# Altium schematic sheet Power_Supply.SchDoc
size A3; SheetNumber: 19; SheetTotal: 35
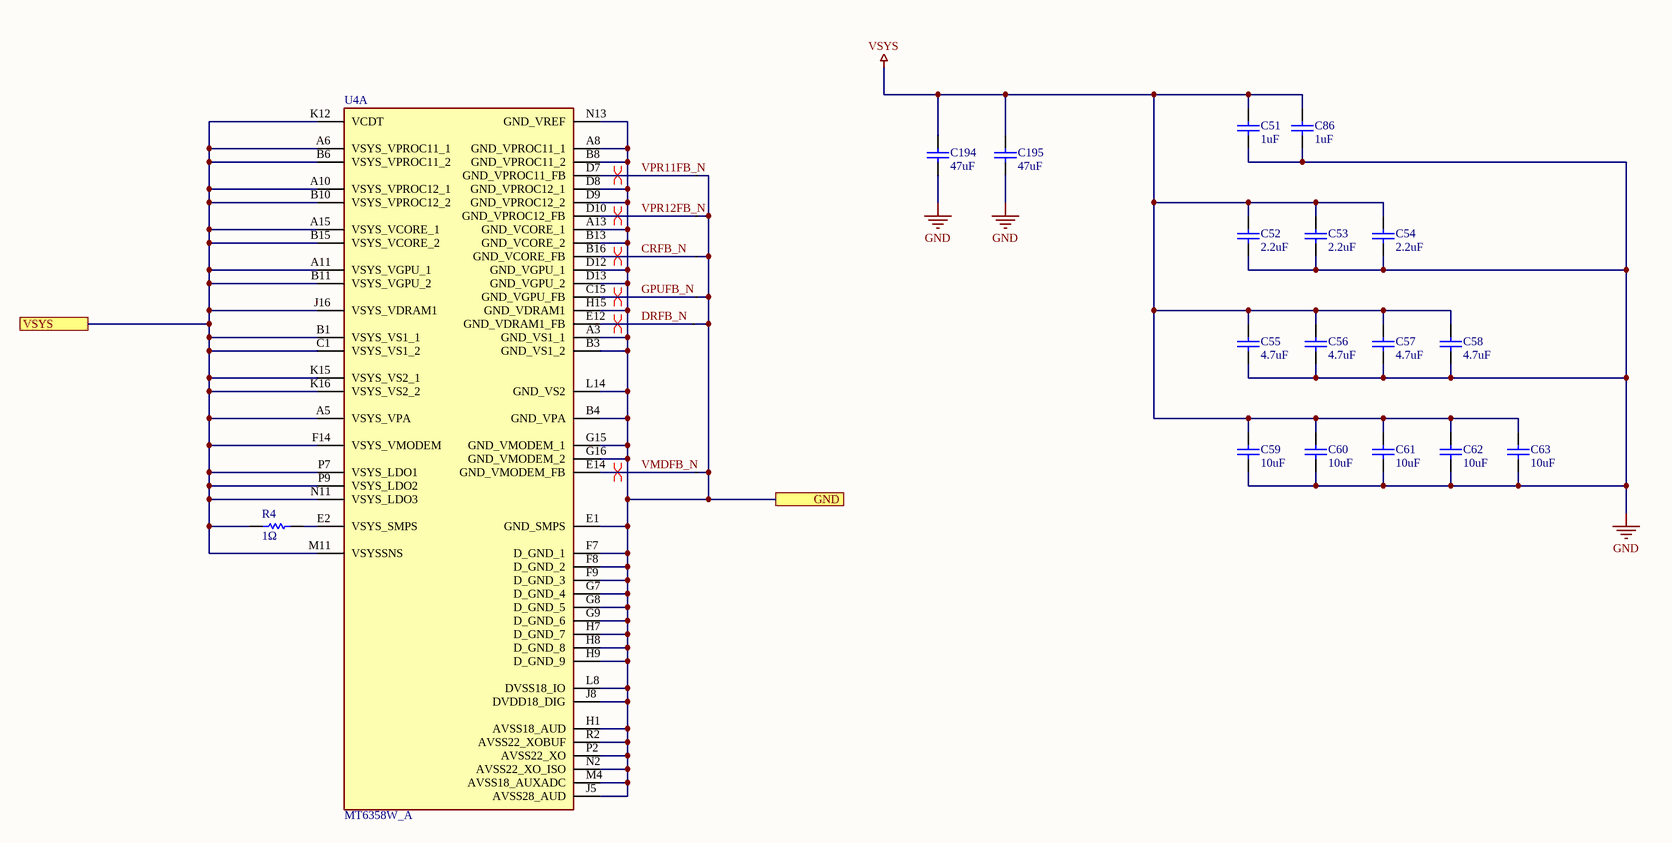
[diagram p0: Power_Supply.SchDoc]

## Parts
.1  P  [P]  (value not drawn)
.2  P  [P]  (value not drawn)
.3  P  [P]  (value not drawn)
.4  P  [P]  (value not drawn)
.5  P  [P]  (value not drawn)
.8  P  [P]  (value not drawn)
C51  value 1uF  [C0805]  (hidden comment: C0805)
C52  value 2.2uF  [C0805]  (hidden comment: C0805)
C53  value 2.2uF  [C0805]  (hidden comment: C0805)
C54  value 2.2uF  [C0805]  (hidden comment: C0805)
C55  value 4.7uF  [C0805]  (hidden comment: C0805)
C56  value 4.7uF  [C0805]  (hidden comment: C0805)
C57  value 4.7uF  [C0805]  (hidden comment: C0805)
C58  value 4.7uF  [C0805]  (hidden comment: C0805)
C59  value 10uF  [C1210]  (hidden comment: C1210)
C60  value 10uF  [C1210]  (hidden comment: C1210)
C61  value 10uF  [C1210]  (hidden comment: C1210)
C62  value 10uF  [C1210]  (hidden comment: C1210)
C63  value 10uF  [C1210]  (hidden comment: C1210)
C86  value 1uF  [C0805]  (hidden comment: C0805)
C194  value 47uF  [C1812]  (hidden comment: C1812)
C195  value 47uF  [C1812]  (hidden comment: C1812)
R4  value 1Ω  [R0603]  (hidden comment: R0603)
U4  MT6358W_A  [BGA194C40P16X15_640X600X66]  (part A of 6)

## Ports
GND (see Power[5000,7200]), VSYS (see Power[5000,7800])

## Nets
GND: C51.1 C52.1 C53.1 C54.1 C55.1 C56.1 C57.1 C58.1 C59.1 C60.1 C61.1 C62.1 C63.1 C86.1 C194.1 C195.1
VSYS: C51.2 C52.2 C53.2 C54.2 C55.2 C56.2 C57.2 C58.2 C59.2 C60.2 C61.2 C62.2 C63.2 C86.2 C194.2 C195.2
CRFB_N: .3.1 U4.B16(GND_VCORE_FB)
DRFB_N: .8.1 U4.E12(GND_VDRAM1_FB)
GND: .1.2 .2.2 .3.2 .4.2 .5.2 .8.2 U4.A3(GND_VS1_1) U4.A8(GND_VPROC11_1) U4.A13(GND_VCORE_1) U4.B3(GND_VS1_2) U4.B4(GND_VPA) U4.B8(GND_VPROC11_2) U4.B13(GND_VCORE_2) U4.D8(GND_VPROC12_1) U4.D9(GND_VPROC12_2) U4.D12(GND_VGPU_1) U4.D13(GND_VGPU_2) U4.E1(GND_SMPS) U4.F7(D_GND_1) U4.F8(D_GND_2) U4.F9(D_GND_3) U4.G7(D_GND_4) U4.G8(D_GND_5) U4.G9(D_GND_6) U4.G15(GND_VMODEM_1) U4.G16(GND_VMODEM_2) U4.H1(AVSS18_AUD) U4.H7(D_GND_7) U4.H8(D_GND_8) U4.H9(D_GND_9) U4.H15(GND_VDRAM1) U4.J5(AVSS28_AUD) U4.J8(DVDD18_DIG) U4.L8(DVSS18_IO) U4.L14(GND_VS2) U4.M4(AVSS18_AUXADC) U4.N2(AVSS22_XO_ISO) U4.N13(GND_VREF) U4.P2(AVSS22_XO) U4.R2(AVSS22_XOBUF) ; port GND  [a separate net that carries the same name]
GPUFB_N: .4.1 U4.C15(GND_VGPU_FB)
VMDFB_N: .5.1 U4.E14(GND_VMODEM_FB)
VPR11FB_N: .1.1 U4.D7(GND_VPROC11_FB)
VPR12FB_N: .2.1 U4.D10(GND_VPROC12_FB)
VSYS: R4.1 U4.A5(VSYS_VPA) U4.A6(VSYS_VPROC11_1) U4.A10(VSYS_VPROC12_1) U4.A11(VSYS_VGPU_1) U4.A15(VSYS_VCORE_1) U4.B1(VSYS_VS1_1) U4.B6(VSYS_VPROC11_2) U4.B10(VSYS_VPROC12_2) U4.B11(VSYS_VGPU_2) U4.B15(VSYS_VCORE_2) U4.C1(VSYS_VS1_2) U4.F14(VSYS_VMODEM) U4.J16(VSYS_VDRAM1) U4.K12(VCDT) U4.K15(VSYS_VS2_1) U4.K16(VSYS_VS2_2) U4.M11(VSYSSNS) U4.N11(VSYS_LDO3) U4.P7(VSYS_LDO1) U4.P9(VSYS_LDO2) ; port VSYS  [a separate net that carries the same name]
NetR4_2: R4.2 U4.E2(VSYS_SMPS)

## Layout directives
differential pair: CRFB_N, DRFB_N, GPUFB_N, VMDFB_N, VPR11FB_N, VPR12FB_N

## Library data of the parts
U4 = MT6358W_A: PMIC; Manufacturer_Name: Mediatek; Manufacturer_Part_Number: MT6358W/A; Datasheet Link: https://www.mouser.com/catalog/specsheets/MediaTek_MTK_MT6358_Product_Brief_v1_0.pdf?_gl=1*14yevt7*_ga*OTAyMjU2NDU3LjE2ODExMDUyMzk.*_ga_1KQLCYKRX3*MTcwODA1NjU3MS4xMTcuMC4xNzA4MDU2NTczLjAuMC4w*_ga_15W4STQT4T*MTcwODA1NjU3Mi4xNzIuMC4xNzA4MDU2NTczLjU5LjAuMA..; Height: 0.66mm; Mouser Part Number: 840-MT6358W/A; Mouser Price/Stock: https://www.mouser.co.uk/ProductDetail/MediaTek/MT6358W-A?qs=Jm2GQyTW%2FbiK3FZkyfX0lQ%3D%3D